# Altium project miniVent_PCB_prj.PrjPcb
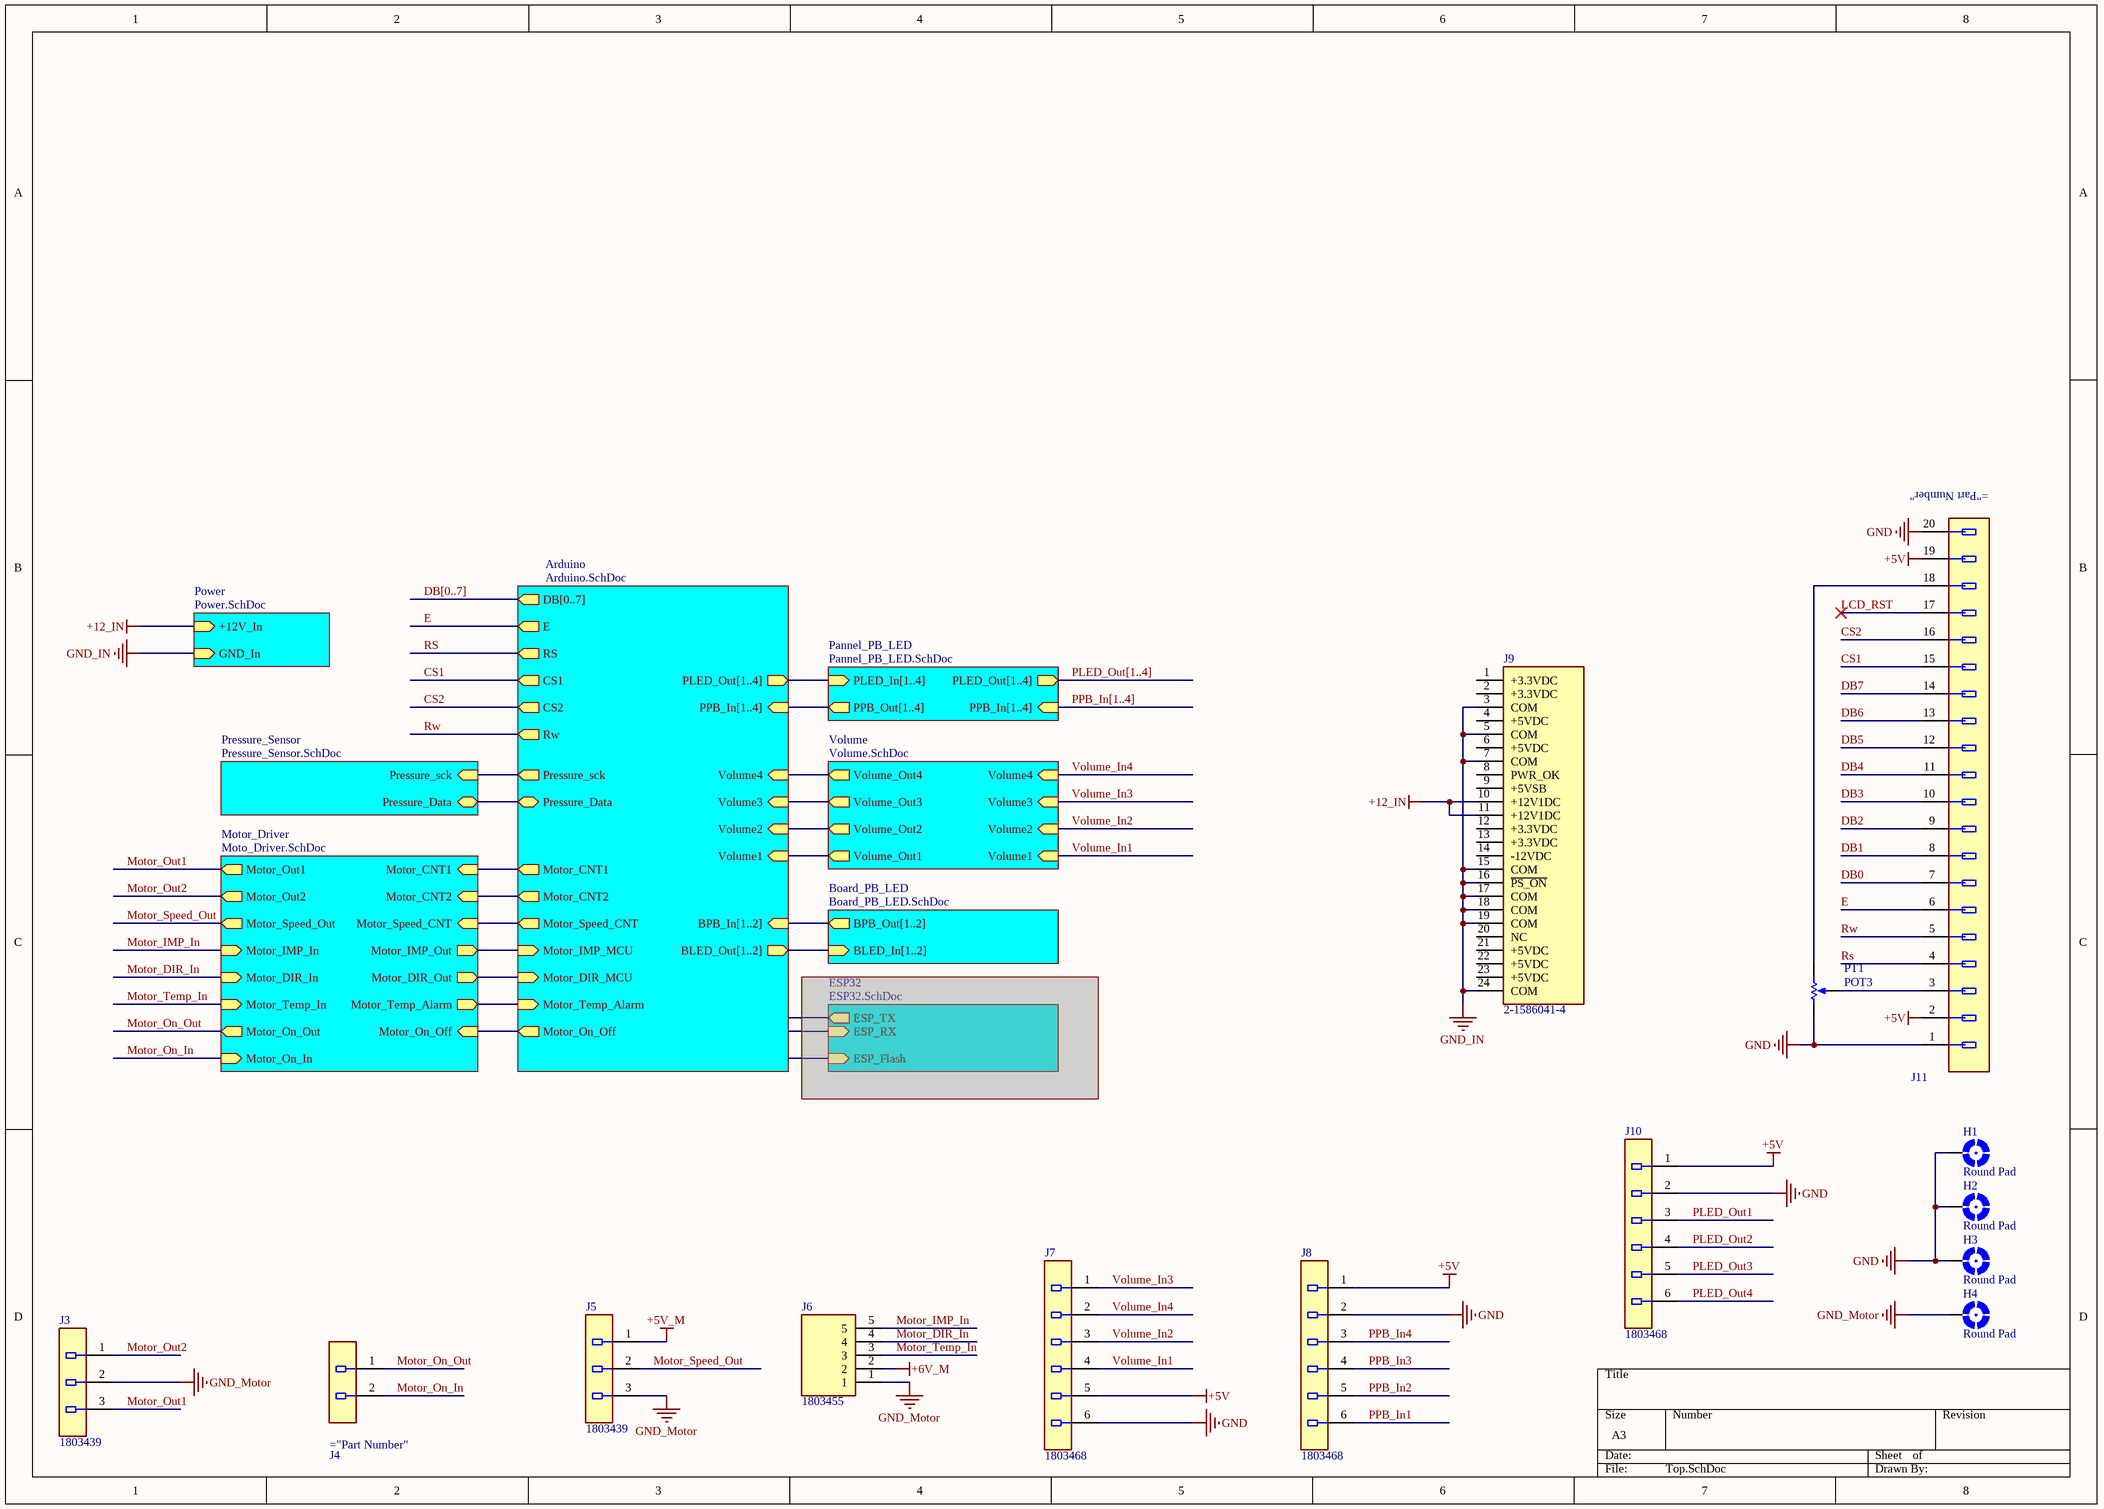
[diagram p0: Top.SchDoc]
8 sheets, 164 parts. Net scope: hierarchical (ports join the sheet entries above them; power ports are global).
Board file: miniVent_PCB_v1_0.PcbDoc
Sheets:
  Top.SchDoc
    Power = Power.SchDoc
    Arduino = Arduino.SchDoc
    Pannel_PB_LED = Pannel_PB_LED.SchDoc
    Volume = Volume.SchDoc
    Board_PB_LED = Board_PB_LED.SchDoc
    Motor_Driver = Moto_Driver.SchDoc
    Pressure_Sensor = Pressure_Sensor.SchDoc

## Sheet Top.SchDoc
size A3

### Parts
H1  Round Pad  [P3.0C]  (no BOM)
H2  Round Pad  [P3.0C]  (no BOM)
H3  Round Pad  [P3.0C]  (no BOM)
H4  Round Pad  [P3.0C]  (no BOM)
J3  Part Number: 1803439  [Phoenix_Contact_1803439_0]  (hidden comment: Conn_Phoenix_Contact_1803439_eec)
J4  1843606  [Phoenix_Contact_1843606_MFG]  (value not drawn)
J5  Part Number: 1803439  [Phoenix_Contact_1803439_0]  (hidden comment: Conn_Phoenix_Contact_1803439_eec)
J6  1803455  [SHDR5W100P0X381_1X5_2044X725X920P]
J7  Part Number: 1803468  [Phoenix_Contact_1803468_0]  (hidden comment: Conn_Phoenix_Contact_1803468_eec)
J8  Part Number: 1803468  [Phoenix_Contact_1803468_0]  (hidden comment: Conn_Phoenix_Contact_1803468_eec)
J9  2-1586041-4  [Molex24Pin - Vertical]
J10  Part Number: 1803468  [Phoenix_Contact_1803468_0]  (hidden comment: Conn_Phoenix_Contact_1803468_eec)
J11  TSS-110-01-G-D  [Samtec_Inc._http--suddendocs.samtec.com-prints-tss-tstd.pdf_0]  (value not drawn)
PT1  POT3  [POT3]

### Sub-sheets
Arduino = Arduino.SchDoc: DB[0..7] (out), PLED_Out[1..4] (out), Motor_Temp_Alarm (in), Motor_Speed_CNT (out), Motor_DIR_MCU (in), Volume1 (in), PPB_In[1..4] (in), BPB_In[1..2] (in), Motor_CNT2 (out), Volume3 (in), Motor_CNT1 (out), Pressure_Data (bidir), Motor_On_Off (out), E (out), Volume2 (in), CS2 (out), Volume4 (in), Rw (out), CS1 (out), RS (out), Pressure_sck (out), BLED_Out[1..2] (out), Motor_IMP_MCU (in)
Board_PB_LED = Board_PB_LED.SchDoc: BPB_Out[1..2] (out), BLED_In[1..2] (in)
ESP32 = ESP32.SchDoc (masked out) (file not in this document): ESP_TX (out), ESP_RX (in), ESP_Flash (in)
Motor_Driver = Moto_Driver.SchDoc: Motor_Out1 (out), Motor_CNT1 (in), Motor_CNT2 (in), Motor_Out2 (out), Motor_Speed_CNT (in), Motor_Speed_Out (out), Motor_IMP_Out (out), Motor_On_Out (out), Motor_On_Off (in), Motor_Temp_Alarm (out), Motor_DIR_In (in), Motor_Temp_In (in), Motor_IMP_In (in), Motor_DIR_Out (out), Motor_On_In (in)
Pannel_PB_LED = Pannel_PB_LED.SchDoc: PLED_In[1..4] (in), PLED_Out[1..4] (out), PPB_Out[1..4] (out), PPB_In[1..4] (in)
Power = Power.SchDoc: +12V_In (in), GND_In (in)
Pressure_Sensor = Pressure_Sensor.SchDoc: Pressure_sck (in), Pressure_Data (bidir)
Volume = Volume.SchDoc: Volume_Out3 (out), Volume3 (in), Volume_Out1 (out), Volume2 (in), Volume1 (in), Volume_Out4 (out), Volume_Out2 (out), Volume4 (in)

### Nets
+5V: J7.5 J8.1 J10.1 J11.2 J11.19
+5V_M: J5.1
+6V_M: J6.2
+12_IN: J9.10(+12V1DC) J9.11(+12V1DC) ; sheet Power/+12V_In
GND: H1.P H2.P H3.P H4.P J3.2 J5.3 J6.1 J7.6 J8.2 J10.2 J11.1 J11.20 PT1.1(TOP)  [also labelled GND_Motor, SHIELD]
GND_IN: J9.3(COM) J9.5(COM) J9.7(COM) J9.15(COM) J9.16(~{PS_ON}) J9.17(COM) J9.18(COM) J9.19(COM) J9.24(COM) ; sheet Power/GND_In
CS1: J11.15 ; sheet Arduino/CS1
CS2: J11.16 ; sheet Arduino/CS2
DB0: J11.7
DB1: J11.8
DB2: J11.9
DB3: J11.10
DB4: J11.11
DB5: J11.12
DB6: J11.13
DB7: J11.14
E: J11.6 ; sheet Arduino/E
LCD_RST: J11.17
Motor_CNT1: sheet Arduino/Motor_CNT1, sheet Motor_Driver/Motor_CNT1
Motor_CNT2: sheet Arduino/Motor_CNT2, sheet Motor_Driver/Motor_CNT2
Motor_DIR_In: J6.4 ; sheet Motor_Driver/Motor_DIR_In
Motor_DIR_MCU: sheet Arduino/Motor_DIR_MCU, sheet Motor_Driver/Motor_DIR_Out
Motor_IMP_In: J6.5 ; sheet Motor_Driver/Motor_IMP_In
Motor_IMP_MCU: sheet Arduino/Motor_IMP_MCU, sheet Motor_Driver/Motor_IMP_Out
Motor_On_In: J4.2 ; sheet Motor_Driver/Motor_On_In
Motor_On_Off: sheet Arduino/Motor_On_Off, sheet Motor_Driver/Motor_On_Off
Motor_On_Out: J4.1 ; sheet Motor_Driver/Motor_On_Out
Motor_Out1: J3.3 ; sheet Motor_Driver/Motor_Out1
Motor_Out2: J3.1 ; sheet Motor_Driver/Motor_Out2
Motor_Speed_CNT: sheet Arduino/Motor_Speed_CNT, sheet Motor_Driver/Motor_Speed_CNT
Motor_Speed_Out: J5.2 ; sheet Motor_Driver/Motor_Speed_Out
Motor_Temp_Alarm: sheet Arduino/Motor_Temp_Alarm, sheet Motor_Driver/Motor_Temp_Alarm
Motor_Temp_In: J6.3 ; sheet Motor_Driver/Motor_Temp_In
PLED_Out1: J10.3
PLED_Out2: J10.4
PLED_Out3: J10.5
PLED_Out4: J10.6
PPB_In1: J8.6
PPB_In2: J8.5
PPB_In3: J8.4
PPB_In4: J8.3
Pressure_Data: sheet Arduino/Pressure_Data, sheet Pressure_Sensor/Pressure_Data
Pressure_sck: sheet Arduino/Pressure_sck, sheet Pressure_Sensor/Pressure_sck
Rs: J11.4 ; sheet Arduino/RS
Rw: J11.5 ; sheet Arduino/Rw
Volume1: sheet Arduino/Volume1, sheet Volume/Volume_Out1
Volume2: sheet Arduino/Volume2, sheet Volume/Volume_Out2
Volume3: sheet Arduino/Volume3, sheet Volume/Volume_Out3
Volume4: sheet Arduino/Volume4, sheet Volume/Volume_Out4
Volume_In1: J7.4 ; sheet Volume/Volume1
Volume_In2: J7.3 ; sheet Volume/Volume2
Volume_In3: J7.1 ; sheet Volume/Volume3
Volume_In4: J7.2 ; sheet Volume/Volume4
NetJ11_3: J11.3 PT1.3(TAP)
NetJ11_18: J11.18 PT1.2(BOT)

Not connected (* = marked no-connect by the designer): J9 1(+3.3VDC) 2(+3.3VDC) 4(+5VDC) 6(+5VDC) 8(PWR_OK) 9(+5VSB) 12(+3.3VDC) 13(+3.3VDC) 14(-12VDC) 20(NC) 21(+5VDC) 22(+5VDC) 23(+5VDC)

### Buses and harness runs
bus DB[0..7] = sheet Arduino/DB[0..7]
bus PLED_Out[1..4] = sheet Pannel_PB_LED/PLED_Out[1..4]
bus PPB_In[1..4] = sheet Pannel_PB_LED/PPB_In[1..4]
bus sheet Arduino/BLED_Out[1..2] = sheet Board_PB_LED/BLED_In[1..2]
bus sheet Arduino/BPB_In[1..2] = sheet Board_PB_LED/BPB_Out[1..2]
bus sheet Arduino/PLED_Out[1..4] = sheet Pannel_PB_LED/PLED_In[1..4]
bus sheet Arduino/PPB_In[1..4] = sheet Pannel_PB_LED/PPB_Out[1..4]

### Library data of the parts
H1-H4 = MOUNT-PAD-ROUND: MOUNTING PAD, round
J3 J5 = Conn_Phoenix_Contact_1803439_eec: CONN 3 Position Terminal Block Header, Male Pins, Shrouded (4 Side) 0.150" (3.81mm) Vertical Through Hole; Manufacturer: Phoenix Contact; Current: 8A; Number of Positions: 3; Voltage - UL: 300V; Voltage - IEC: 250V; helpURL: https://upverter.com/upn/revision/15cf6a4194e13e43/; ComponentLink2Description: Datasheet; Temperature: to; Package: HDR03; Supplier 2: Mouser; Price: 1.01681353673; Supplier 1: Digi-Key; ComponentLink1URL: https://upverter.com/upn/revision/15cf6a4194e13e43/; Supplier Part Number 2: 651-1803439; Supplier Part Number 1: 277-1222-ND; ComponentLink1Description: Upverter; ComponentLink2URL: https://www.phoenixcontact.com/online/portal/ca/pxc/product_detail_page/!ut/p/b1/3ZfJjqNIEIafpR6AdrKbI_tmMDuGCwKM2YzBYNanH1epNYcZVdel5YPJEyjEry8y4s-MXbgLYHi_J3CCQPDdaRfe4qnM40fZ3uLr53tIRJSoEwDBCBgIJg5oBjEVUnUIEkF3_u4EsMiu1k492It-sDHlbi8yHOwHVesM1QUjMDMVR8xGsF3fyzpJKbMGb3m-ldRMvdytogjEpUzEa8lZ9WDWMrMfblh9r_G9jx23obf2YSs-2rv4yBnWYYhKP6Qt7R-f_-vW1r0u1lUoq1adcqJY64DoyrtY5gFB9r04PgKRloXATq5-UXB1rJW0WkCjM3884YLv4SwL_MQePAPIbwNofOfsTp4LH7hWnnkOOTArw_XmlI6IdJtrNOQymFamkLNrkZpsxL5rt4NN4RNT9W1XVFr7OAp8r54RYI96zPDufnQMXusajRdMglVtvbrxB4zkJlzcIkvpNmZLT-GVaR_QSeLSBU_I0uAFuzTwPpZg6WzD_F29V3iNVlF0sagDr-69_VydVgaLOBF44TK1Hz-BkW8KZmLvCka8K9i79pj5rj1GvGuPEe_aY8S79pj2tqX4ruahwZ9gJzfSP8E4iSg7m86AZnOldR6lvtQQKldj0xZDx5ipFru0uAyccwdFJyLPVeUWkwuio7balMKGiIEYKou4Ojw-m_Ps-YOed7PU7bu5OO4viE1KIEZPaI6BhEwUT0bv8T26k0lT1IVnyIcTm9RCG5kMLqD80NZGu2IkhFs1DPIH3vnMPiuW1Jh8JiWNGUPCG-poAqyWAhworNYfeYPOlHW-eN3QQH1DreMULztlF5ZJ82tOm1_gV7ekv7q-PY_pIzpnj7i8Rl2cZztPSYeFHbSZ45NiQBxTbG5HO5QHKxGEuGeuICKFNYN7ZEQX7Hj0HuvFFArVRqcxrSpV8utyrCdYB1cMrmtbwBpc5O89Jx22CMvVCSNuOJBiU-BRyMIheo51xkUxYATodnThS4xTbmt-fDxHgPBPN-Wvi_RXAPjmocHOzm4RS0fGiWXpH4pART6L4PfQIW_1ZlVgBro7ILpbb2DzdK06-brDz7rO6A-OXgAPVsd57jPnPvcaA87jZJw9y2VoVqX1c_6TIPxqQfTFguyrBe1XpxQBrxb8-4Tf2sK1HB5fpjB8usL2ZY487eQhJJkBdFs9iq2mnJEoXkVCz7WhQg9okqAqD2tq0EBucCSmsKr8gKUv52hDkiplykueytOF0UzYoeUmPFqGQvNIxiYGMWE9QwxF4uZQ7MispJFQRRE-D0dNlWayA-7UBJNixy0hNw4I1cutopgdIKnHWISwCmAnJ1YYLpTDnfUsz-qpWJ7usHq7Nr53SY6H2_rpLLrUNtkPiZbx_yV6M2edpGen0mYYgE0jJVN_JlbXbdjmwQJ6T7MrddN5WHW45-mnS78TTYdLfpN_EiRfLMiDVwsiLxZ0X03own9d0N8Ff54O_D4b2rFPs511zi7xeH3szDROi-yQTdnV-DzTm7BfofiblYAK-8-XGd7_u6CA_vgHnVCNeg!!/dl4/d5/L2dBISEvZ0FBIS9nQSEh/pw/Z7_9GN6024610FQ50AB2QJ7KT6766/act/id=0/p=downloadId=2845392/p=action=downloadFile/349172715691/-/; RoHS: TRUE; Mouser Part Number: 651-1803439; Digikey Description: CONN 3 Position Terminal Block Header, Male Pins, Shrouded (4 Side) 0.150" (3.81mm) Vertical Through Hole; Digikey Part Number: 277-1222-ND; Lead Free: yes; Pitch: 3.81mm
J6 = 1803455: Connector; Manufacturer_Name: Phoenix Contact; Allied_Number: 70054558; Datasheet Link: http://uk.rs-online.com/web/p/products/2204866; Height: 9.2mm; Manufacturer_Part_Number: 1803455; Mouser Part Number: 651-1803455; Mouser Price/Stock: https://www.mouser.co.uk/ProductDetail/Phoenix-Contact/1803455?qs=ChwaSN6Xm4%252Bowd0eKzWfkQ%3D%3D; RS Part Number: 2204866; RS Price/Stock: http://uk.rs-online.com/web/p/products/2204866; Allied Price/Stock: http://www.alliedelec.com/phoenix-contact-1803455/70054558/
J7 J8 J10 = Conn_Phoenix_Contact_1803468_eec: CONN TERM BLOCK HDR 6POS VERT 3.81MM; Manufacturer: Phoenix Contact; helpURL: https://upverter.com/upn/revision/3db961df2b2b7a0d/; ComponentLink2Description: Datasheet; Temperature: to; Package: HDR6; Supplier 2: Mouser; Price: 1.88397784029; Supplier 1: Digi-Key; ComponentLink1URL: https://upverter.com/upn/revision/3db961df2b2b7a0d/; Supplier Part Number 2: 651-1803468; Supplier Part Number 1: 277-1225-ND; ComponentLink1Description: Upverter; ComponentLink2URL: http://media.digikey.com/pdf/Data%20Sheets/Phoenix%20Contact%20PDFs/1803468.pdf; RoHS: TRUE; Mouser Part Number: 651-1803468; Digikey Description: CONN TERM BLOCK HDR 6POS VERT 3.81MM; Digikey Part Number: 277-1225-ND; Lead Free: yes; Mounting Type: Through Hole
J9 = ATX Power Receptor: ATX main 24 PIN; MF: TE Connectivity; Value: *; TE_purchase_URL: https://www.te.com/usa-en/product-2-1586041-4.html?te_bu=Cor&te_type=disp&te_campaign=seda_glo_cor-seda-global-disp-prtnr-fy19-seda-model-bom-cta_sma-317_1&elqCampaignId=32493; Price: None; Package: None; SnapEDA_Link: https://www.snapeda.com/parts/2-1586041-4/TE%20Connectivity%20AMP%20Connectors/view-part/2469079/?ref=snap; Availability: Unavailable; MP: 2-1586041-4
PT1 = POT3: Variable Potentiometer top adjust; Designer: Seyed Mohsen Ghasemian; WEB: www.picpars.com

## Sheet Power.SchDoc
size A4
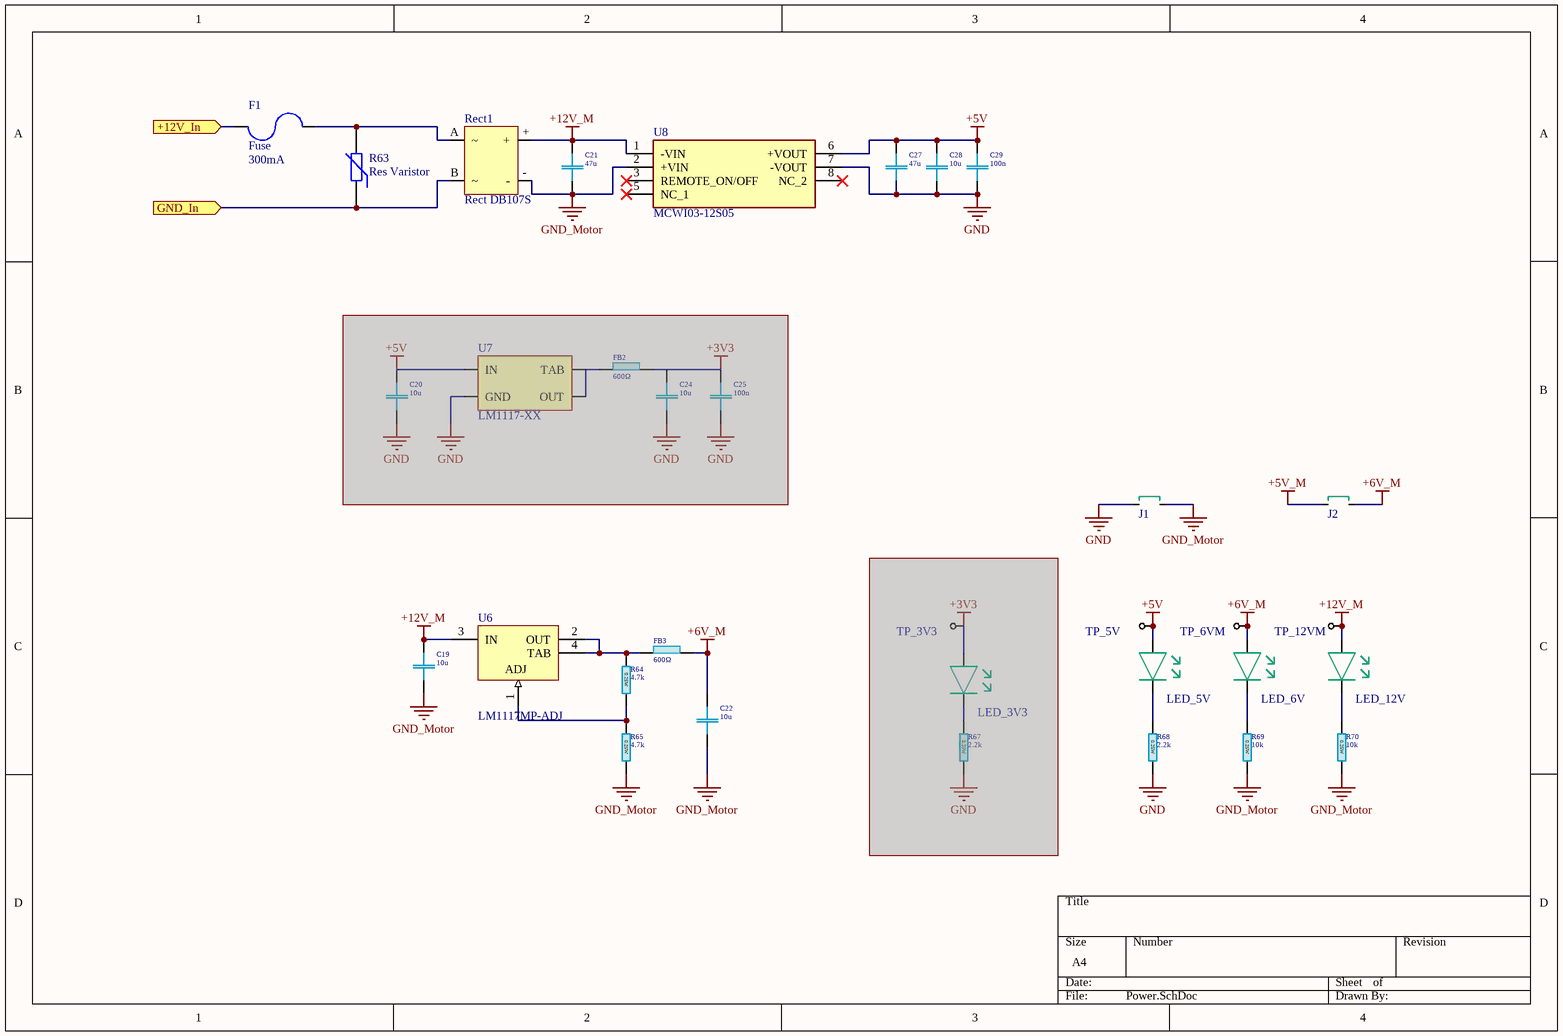
[diagram p1: Power.SchDoc]

### Parts
C19  10u  [C1206]
C20  10u  [C1206]  (masked out: inside a compile mask, not in the netlist)
C21  47u  [C1206]
C22  10u  [C1206]
C24  10u  [C1206]  (masked out: inside a compile mask, not in the netlist)
C25  100n  [C1206]  (masked out: inside a compile mask, not in the netlist)
C27  47u  [C1206]
C28  10u  [C1206]
C29  100n  [C1206]
F1  Fuse  value 300mA  [R1206]
FB2  ZTyp@100MHz: 600Ω  [L1206]  (hidden comment: 0.955u)  (masked out: inside a compile mask, not in the netlist)
FB3  ZTyp@100MHz: 600Ω  [L1206]  (hidden comment: 0.955u)
J1  Jumper  [JUMPER2]  (value not drawn)
J2  Jumper  [JUMPER2]  (value not drawn)
LED_3V3  LED  [LED 1206]  (value not drawn)  (masked out: inside a compile mask, not in the netlist)
LED_5V  LED  [LED 1206]  (value not drawn)
LED_6V  LED  [LED 1206]  (value not drawn)
LED_12V  LED  [LED 1206]  (value not drawn)
R63  Res Varistor  [BOURNS_MOV-07D431K_0]
R64  4.7k  [R1206]
R65  4.7k  [R1206]
R67  2.2k  [R1206]  (masked out: inside a compile mask, not in the netlist)
R68  2.2k  [R1206]
R69  10k  [R1206]
R70  10k  [R1206]
Rect1  Rect DB107S  [DB107S]
TP_3V3  Test Point  [Test Point Small]  (value not drawn)  (masked out: inside a compile mask, not in the netlist)
TP_5V  Test Point  [Test Point Small]  (value not drawn)
TP_6VM  Test Point  [Test Point Small]  (value not drawn)
TP_12VM  Test Point  [Test Point Small]  (value not drawn)
U6  LM1117MP-ADJ  [MP04A_N]
U7  LM1117-XX  [SOT230-LM1117-xx]  (masked out: inside a compile mask, not in the netlist)
U8  MCWI03-12S05  [MCWI0312S05]

### Ports
+12V_In (in), GND_In (in)

### Nets
+5V: C27.1 C28.1 C29.1 LED_5V.A TP_5V.1(T) U8.6(+VOUT)
+5V_M: J2.1
+6V_M: C22.1 FB3.2 J2.2 LED_6V.A TP_6VM.1(T)
+12_IN: F1.1 ; port +12V_In
+12V_M: C19.1 C21.1 LED_12V.A Rect1.+ TP_12VM.1(T) U6.3(IN) U8.1(-VIN)
GND: C19.2 C21.2 C22.2 C27.2 C28.2 C29.2 J1.1 J1.2 R65.2 R68.2 R69.2 R70.2 Rect1.- U8.2(+VIN) U8.7(-VOUT)  [also labelled GND_Motor]
GND_IN: R63.1 Rect1.B ; port GND_In
NetF1_2: F1.2 R63.2 Rect1.A
NetFB3_1: FB3.1 R64.1 U6.2(OUT) U6.4(TAB)
NetLED_5V_K: LED_5V.K R68.1
NetLED_6V_K: LED_6V.K R69.1
NetLED_12V_K: LED_12V.K R70.1
NetR64_2: R64.2 R65.1 U6.1(ADJ)

Not connected (* = marked no-connect by the designer): U8 3(REMOTE_ON/OFF)* 5(NC_1)* 8(NC_2)*

### Library data of the parts
C19-C22 C24 C25 C27-C29 = C 1206  100V X7R - 100n: SMD 1206   100V X7R 10%; Part Number: CL31B104KCFNNNE; Manufacturer: Samsung; TYPE: Capacitors; Package-mm: 3216; Mount Type: SMT; Publisher: Hefest; Manufacturer Alternate: *; Part Number Alternate: *; Published: 07.04.2019; Supplier 1: Comet; Supplier Part Number 1: C1206 100nF 100V X7R SAMSUNG; RoHS: Y; Technology: Ceramic  MLCC; Package: 1206; VDC: 100V; TempCo: X7R; Tolerance %: ±10%; VAC: *; ESR Ohm: *; ComponentLink1Description: Datasheet Link; ComponentLink1URL: https://store.comet.bg/download-file.php?id=11; Temperature Range: -55°C ~ +125°C; Price: 0.090; ComponentLink2Description: Characteristics data; ComponentLink2URL: https://store.comet.bg/download-file.php?id=3821
  C19 C20 C22 C24 C28: Value: 10u
  C21 C27: Value: 47u
  C25 C29: Value: 100n
FB2 FB3 = FB BLM31P 600: SMD 1206 1.5A 600Ω/80mΩ; Part Number: BLM31PG601SN1L; Manufacturer: Murata; TYPE: Ferrite Bead; Ind: 0.955uH; DC Resistance: 80mΩ; Material: Ferrite; Package-mm: 3216; Tolerance %: ±25%; Temperature Range: -55°C ~ +125°C; Imax: 1.5A; Irms: *; Isat: *; Technology: Chip; Published: 07.04.2019; Publisher: Hefest; Mount Type: SMT; Package: 1206; ComponentLink1Description: Datasheet Link; ComponentLink1URL: https://store.comet.bg/download-file.php?id=5324; RoHS: Y; Ztyp@1GHz: *; Manufacturer Alternate: *; Supplier 1: Comet; Supplier Part Number 1: BLM31PG601SN1L; Part Number Alternate: *; Price: 0.161; Value: 0.955u
J1 J2 = Jumper: Jumper Wire; Manufacturer: Generic Components; Published: 1999
R63 = Res Varistor: Varistor (Voltage-Sensitive Resistor); Published: 24-Mar-1999; LatestRevisionDate: 29-May-2009; LatestRevisionNote: IPC-7351 Footprint Added.; PackageVersion: Mar-2003; PackageReference: 6-0805; Publisher: Altium Limited; PackageDescription: Chip Resistor 0805 Case Size; Code_IPC: RESC2012
R64 R65 R67-R70 = R 1206-5%: SMD 1206 0.25W   5% 200V; Manufacturer: YAGEO; TempCo: ±100ppm/°C; Package-mm: 3216; Value Code: 102; Part Number: *; Mount Type: SMT; Publisher: Hefest; Manufacturer Alternate: *; Published: 07.04.2019; Supplier 1: Comet; Supplier Part Number 1: R1206 1.0K 5% YAG/ASJ; RoHS: Y; Technology: Thick film; Package: 1206; VDC: 200V; Tolerance %: ±5%; ComponentLink1Description: Datasheet Link; ComponentLink1URL: https://store.comet.bg/download-file.php?id=140; Temperature Range: -55°C ~ +155°C; Price: 0.054; Part Number Alternate: *; TYPE: Resistor; Power: 0.25W
  R64 R65: Value: 4.7k
  R67 R68: Value: 2.2k
  R69 R70: Value: 10k
Rect1 = DB107S
U6 = LM1117MP-ADJ: 800mA Low-Dropout Linear Regulator, 4-pin SOT-223; Manufacturer: National Semiconductor; PackageTopMarking: XYTT*N03A; High-Reliability: Y; CompType: LDO IC; PowerWise: N; ComponentLink4Description: MP04A Package Page; Code_IPC: SOT223-4; PartNumber: LM1117MP-ADJ; ComponentLink1Description: Manufacturer URL; ComponentLink2Description: LM1117 Datasheet; DatasheetVersion: Apr-2006; ComponentLink3URL: http://www.national.com/pf/LM/LM1117.html; ComponentLink1URL: http://www.national.com/; Code_JEDEC: TO-261-AA; RevisionNote: SCH symbol layout adjusted; ComponentLink4URL: http://www.national.com/packaging/folders/mp04a.html; PackageReference: MP04A; ComponentLink3Description: LM1117 Web Page; PackageVersion: revB, Apr-2003; RoHS: N; PinCount: 4; ComponentLink2URL: http://www.national.com/ds/LM/LM1117.pdf; PackageDescription: Molded SOT-223, 6.50 x 3.56 x 1.6mm Body, 4 Lead, 2.3mm Pitch
U7 = LM1117-XX: voltage regulator
U8 = MCWI03-12S05: Power Supply; Manufacturer_Name: Minmax; Datasheet Link: https://minmax.cdistore.com/datasheets/minmax/MCWI03-R2-110412.pdf; Manufacturer_Part_Number: MCWI03-12S05

## Sheet Arduino.SchDoc
size A4
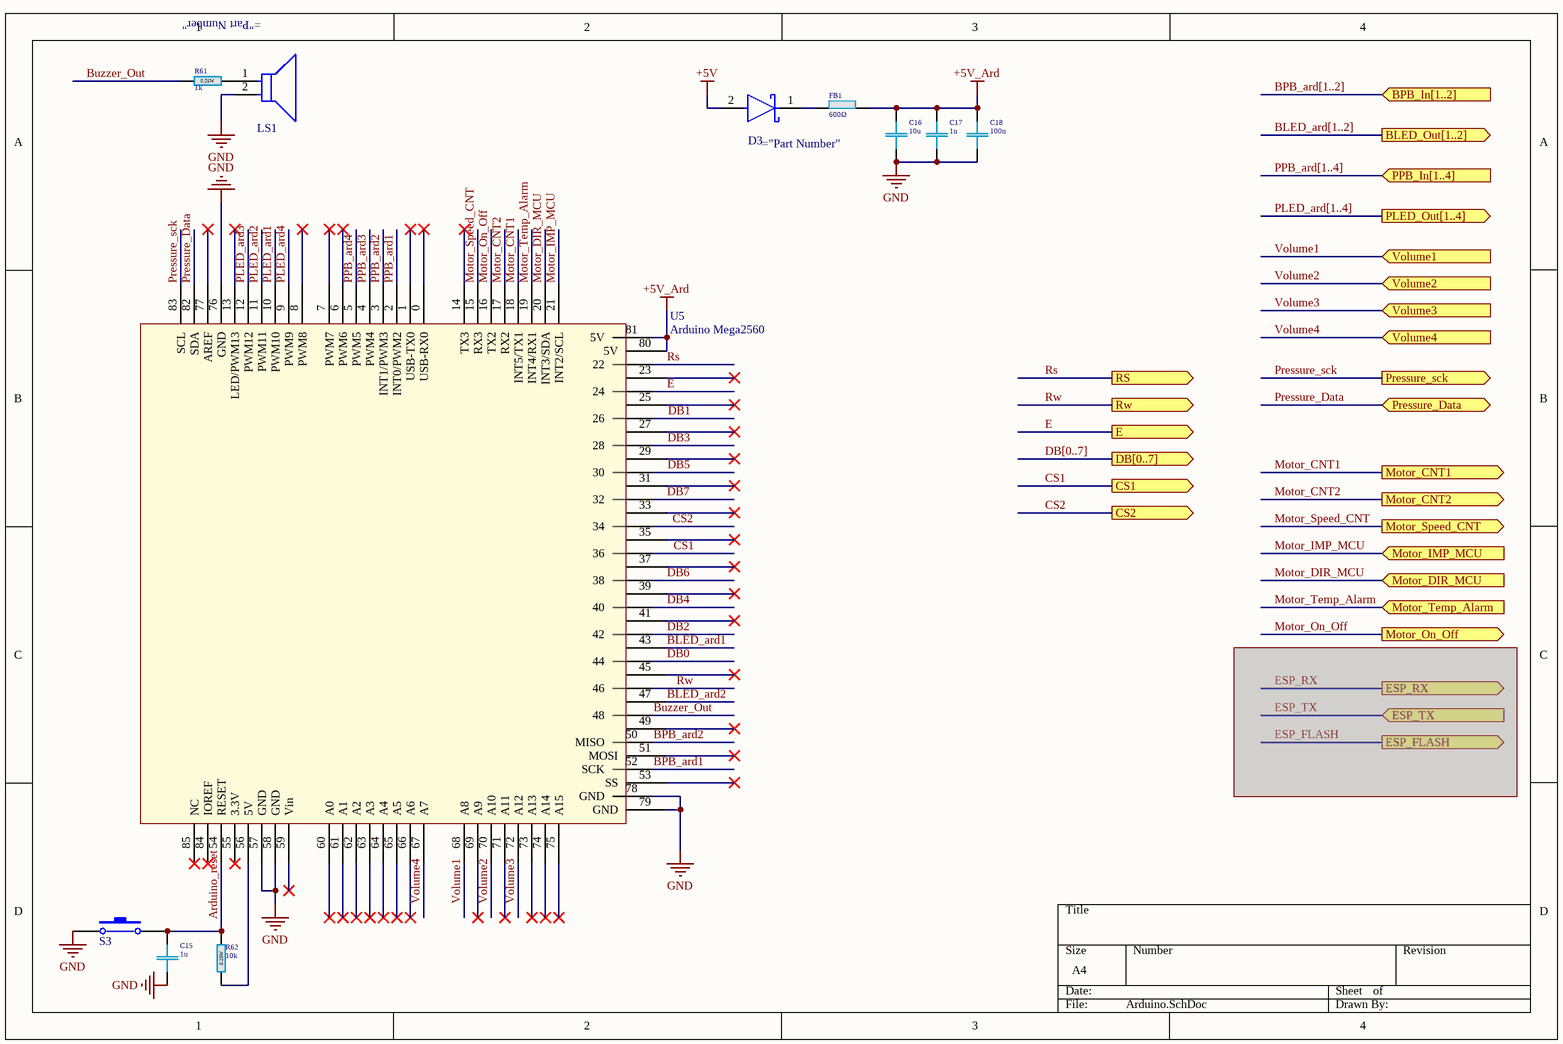
[diagram p2: Arduino.SchDoc]

### Parts
C15  1u  [C1206]
C16  10u  [C1206]
C17  1u  [C1206]
C18  100n  [C1206]
D3  SS34  [DIOM5026X262N]  (value not drawn)
FB1  ZTyp@100MHz: 600Ω  [L1206]  (hidden comment: 0.955u)
LS1  KXG1205C  [BUZZER]  (value not drawn)
R61  1k  [R1206]
R62  10k  [R1206]
S3  PB-2pin  [PB-2pin]  (value not drawn)
U5  Arduino Mega2560  [MEGA2560]

### Ports
BLED_Out[1..2] (out), BPB_In[1..2] (in), CS1 (out), CS2 (out), DB[0..7] (out), E (out), ESP_FLASH (out), ESP_RX (out), ESP_TX (in), Motor_CNT1 (out), Motor_CNT2 (out), Motor_DIR_MCU (in), Motor_IMP_MCU (in), Motor_On_Off (out), Motor_Speed_CNT (out), Motor_Temp_Alarm (in), PLED_Out[1..4] (out), PPB_In[1..4] (in), Pressure_Data (bidir), Pressure_sck (out), RS (out), Rw (out), Volume1 (in), Volume2 (in), Volume3 (in), Volume4 (in)

### Nets
+5V: D3.2(A)
+5V_Ard: C16.1 C17.1 C18.1 FB1.2 U5.80(5V) U5.81(5V)
GND: C15.2 C16.2 C17.2 C18.2 LS1.2(C) S3.1 U5.57(GND) U5.58(GND) U5.76(GND) U5.78(GND) U5.79(GND)
Arduino_reset: C15.1 R62.2 S3.2 U5.54(RESET)
BLED_ard1: U5.43
BLED_ard2: U5.47
BPB_ard1: U5.52(SCK)
BPB_ard2: U5.50(MISO)
Buzzer_Out: R61.1 U5.48
CS1: U5.36 ; port CS1
CS2: U5.34 ; port CS2
DB0: U5.44
DB1: U5.26
DB2: U5.42
DB3: U5.28
DB4: U5.40
DB5: U5.30
DB6: U5.38
DB7: U5.32
E: U5.24 ; port E
Motor_CNT1: U5.18(INT5/TX1) ; port Motor_CNT1
Motor_CNT2: U5.17(RX2) ; port Motor_CNT2
Motor_DIR_MCU: U5.20(INT3/SDA) ; port Motor_DIR_MCU
Motor_IMP_MCU: U5.21(INT2/SCL) ; port Motor_IMP_MCU
Motor_On_Off: U5.16(TX2) ; port Motor_On_Off
Motor_Speed_CNT: U5.15(RX3) ; port Motor_Speed_CNT
Motor_Temp_Alarm: U5.19(INT4/RX1) ; port Motor_Temp_Alarm
PLED_ard1: U5.10(PWM10)
PLED_ard2: U5.11(PWM11)
PLED_ard3: U5.12(PWM12)
PLED_ard4: U5.9(PWM9)
PPB_ard1: U5.2(INT0/PWM2)
PPB_ard2: U5.3(INT1/PWM3)
PPB_ard3: U5.4(PWM4)
PPB_ard4: U5.5(PWM5)
Pressure_Data: U5.82(SDA) ; port Pressure_Data
Pressure_sck: U5.83(SCL) ; port Pressure_sck
Rs: U5.22 ; port RS
Rw: U5.46 ; port Rw
Volume1: U5.68(A8) ; port Volume1
Volume2: U5.70(A10) ; port Volume2
Volume3: U5.72(A12) ; port Volume3
Volume4: U5.67(A7) ; port Volume4
NetD3_1: D3.1(C) FB1.1
NetLS1_1: LS1.1(A) R61.2
NetR62_1: R62.1 U5.56(5V)

Not connected (* = marked no-connect by the designer): U5 0(USB-RX0)* 1(USB-TX0)* 6(PWM6)* 7(PWM7)* 8(PWM8)* 13(LED/PWM13)* 14(TX3)* 23* 25* 27* 29* 31* 33* 35* 37* 39* 41* 45* 49* 51(MOSI)* 53(SS)* 55(3.3V)* 59(Vin)* 60(A0)* 61(A1)* 62(A2)* 63(A3)* 64(A4)* 65(A5)* 66(A6)* 69(A9)* 71(A11)* 73(A13)* 74(A14)* 75(A15)* 77(AREF)* 84(IOREF)* 85(NC)*

### Buses and harness runs
bus BLED_ard[1..2] = port BLED_Out[1..2]
bus BPB_ard[1..2] = port BPB_In[1..2]
bus DB[0..7] = port DB[0..7]
bus PLED_ard[1..4] = port PLED_Out[1..4]
bus PPB_ard[1..4] = port PPB_In[1..4]

### Library data of the parts
C15-C18 = C 1206  100V X7R - 100n: as C19 on sheet Power; Mount Type: SMT; Publisher: Hefest; Manufacturer Alternate: *; Part Number Alternate: *; Published: 07.04.2019; Supplier 1: Comet; Supplier Part Number 1: C1206 100nF 100V X7R SAMSUNG; RoHS: Y; Technology: Ceramic  MLCC; Package: 1206; VDC: 100V; TempCo: X7R; Tolerance %: ±10%; VAC: *; ESR Ohm: *; ComponentLink1Description: Datasheet Link; ComponentLink1URL: https://store.comet.bg/download-file.php?id=11; Temperature Range: -55°C ~ +125°C; Price: 0.090; ComponentLink2Description: Characteristics data; ComponentLink2URL: https://store.comet.bg/download-file.php?id=3821
  C15 C17: Value: 1u
  C16: Value: 10u
  C18: Value: 100n
FB1 = FB BLM31P 600: as FB2 on sheet Power; Temperature Range: -55°C ~ +125°C; Imax: 1.5A; Irms: *; Isat: *; Technology: Chip; Published: 07.04.2019; Publisher: Hefest; Mount Type: SMT; Package: 1206; ComponentLink1Description: Datasheet Link; ComponentLink1URL: https://store.comet.bg/download-file.php?id=5324; RoHS: Y; Ztyp@1GHz: *; Manufacturer Alternate: *; Supplier 1: Comet; Supplier Part Number 1: BLM31PG601SN1L; Part Number Alternate: *; Price: 0.161; Value: 0.955u
R61 R62 = R 1206-5%: as R64 on sheet Power; Part Number: *; Mount Type: SMT; Publisher: Hefest; Manufacturer Alternate: *; Published: 07.04.2019; Supplier 1: Comet; Supplier Part Number 1: R1206 1.0K 5% YAG/ASJ; RoHS: Y; Technology: Thick film; Package: 1206; VDC: 200V; Tolerance %: ±5%; ComponentLink1Description: Datasheet Link; ComponentLink1URL: https://store.comet.bg/download-file.php?id=140; Temperature Range: -55°C ~ +155°C; Price: 0.054; Part Number Alternate: *; TYPE: Resistor; Power: 0.25W
  R61: Value: 1k
  R62: Value: 10k
S3 = PB-2pin: Switch; E-mail: picpars@gmail.com; Designer: Seyed Mohsen Ghasemian; Publisher: www.picpars.com; WEB: www.picpars.com
U5 = Mega_2560: Arduino Mege 2560 R3

## Sheet Pannel_PB_LED.SchDoc
size A4
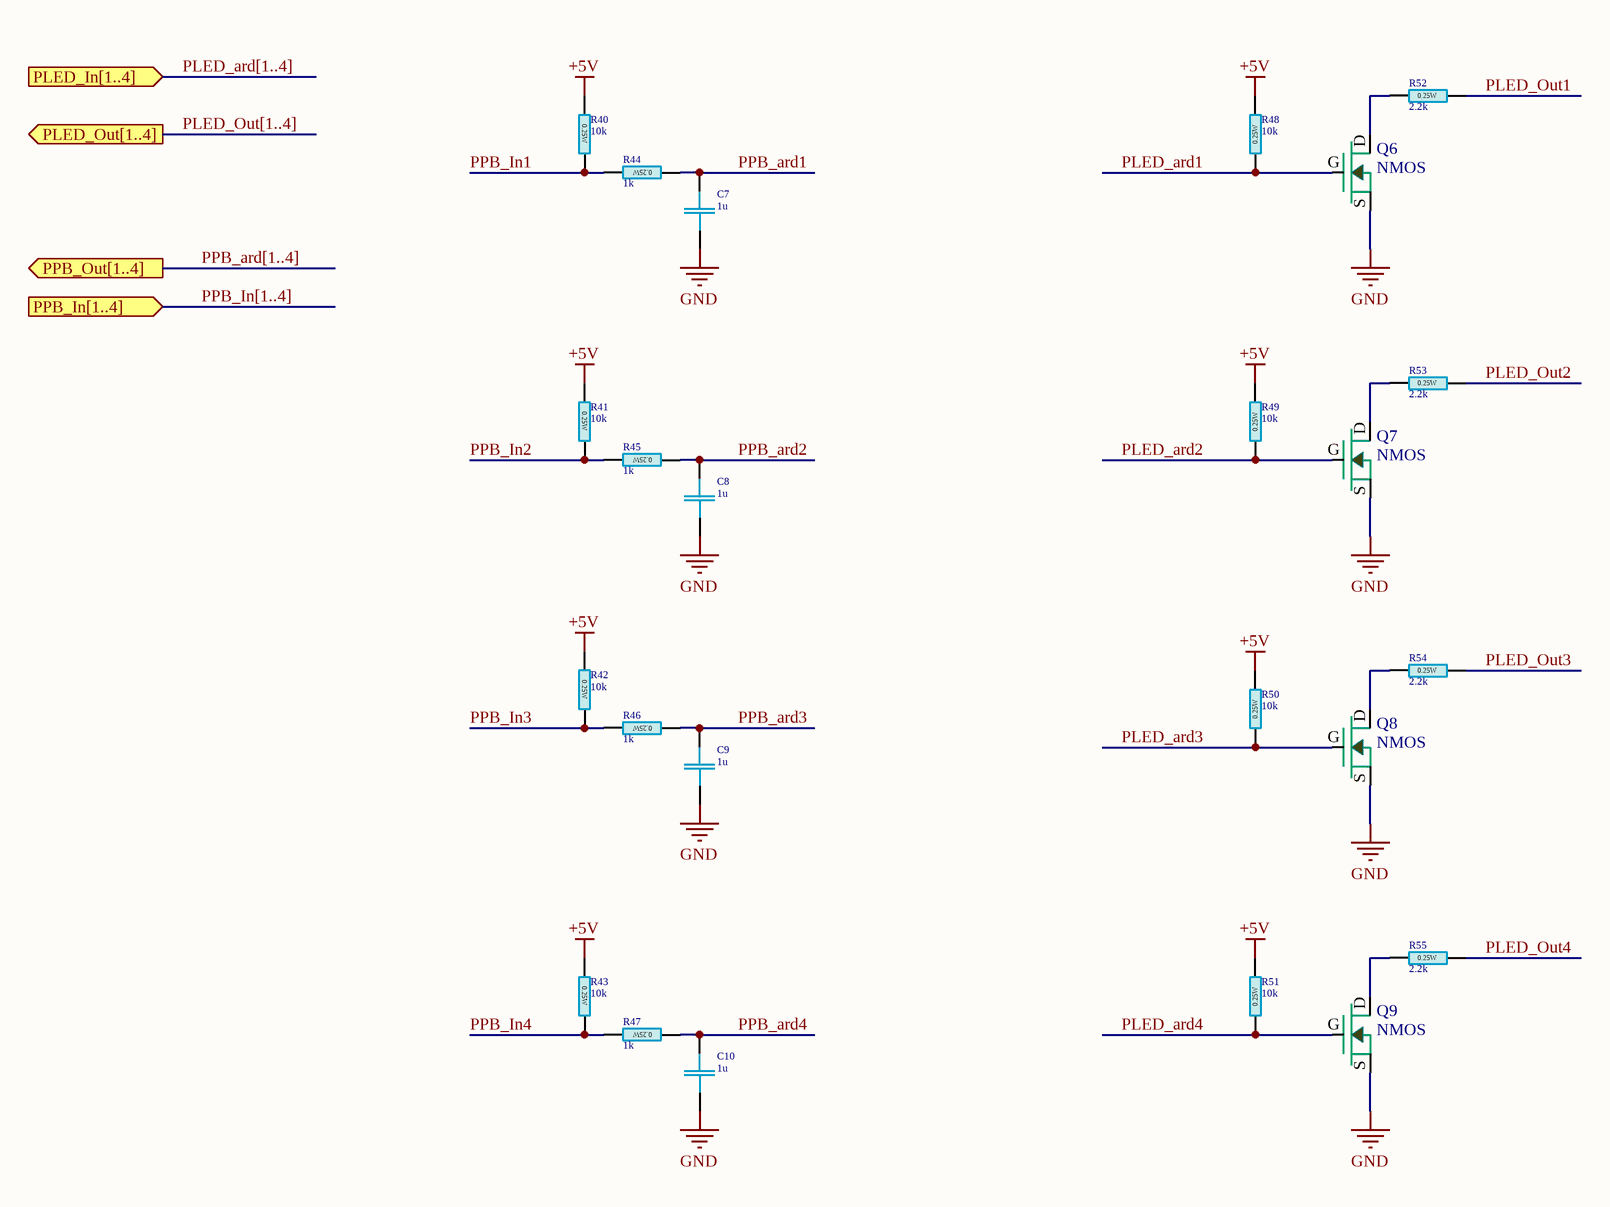
[diagram p3: Pannel_PB_LED.SchDoc]

### Parts
C7  1u  [C1206]
C8  1u  [C1206]
C9  1u  [C1206]
C10  1u  [C1206]
Q6  NMOS  [NMOS SOT-23]
Q7  NMOS  [NMOS SOT-23]
Q8  NMOS  [NMOS SOT-23]
Q9  NMOS  [NMOS SOT-23]
R40  10k  [R1206]
R41  10k  [R1206]
R42  10k  [R1206]
R43  10k  [R1206]
R44  1k  [R1206]
R45  1k  [R1206]
R46  1k  [R1206]
R47  1k  [R1206]
R48  10k  [R1206]
R49  10k  [R1206]
R50  10k  [R1206]
R51  10k  [R1206]
R52  2.2k  [R1206]
R53  2.2k  [R1206]
R54  2.2k  [R1206]
R55  2.2k  [R1206]

### Ports
PLED_In[1..4] (in), PLED_Out[1..4] (out), PPB_In[1..4] (in), PPB_Out[1..4] (out)

### Nets
+5V: R40.1 R41.1 R42.1 R43.1 R48.2 R49.2 R50.2 R51.2
GND: C7.2 C8.2 C9.2 C10.2 Q6.S Q7.S Q8.S Q9.S
PLED_ard1: Q6.G R48.1
PLED_ard2: Q7.G R49.1
PLED_ard3: Q8.G R50.1
PLED_ard4: Q9.G R51.1
PLED_Out1: R52.2
PLED_Out2: R53.2
PLED_Out3: R54.2
PLED_Out4: R55.2
PPB_ard1: C7.1 R44.1
PPB_ard2: C8.1 R45.1
PPB_ard3: C9.1 R46.1
PPB_ard4: C10.1 R47.1
PPB_In1: R40.2 R44.2
PPB_In2: R41.2 R45.2
PPB_In3: R42.2 R46.2
PPB_In4: R43.2 R47.2
NetQ6_D: Q6.D R52.1
NetQ7_D: Q7.D R53.1
NetQ8_D: Q8.D R54.1
NetQ9_D: Q9.D R55.1

### Buses and harness runs
bus PLED_ard[1..4] = port PLED_In[1..4]
bus PLED_Out[1..4] = port PLED_Out[1..4]
bus PPB_ard[1..4] = port PPB_Out[1..4]
bus PPB_In[1..4] = port PPB_In[1..4]

### Library data of the parts
C7-C10 = C 1206  100V X7R - 100n: as C19 on sheet Power; Mount Type: SMT; Publisher: Hefest; Manufacturer Alternate: *; Part Number Alternate: *; Published: 07.04.2019; Supplier 1: Comet; Supplier Part Number 1: C1206 100nF 100V X7R SAMSUNG; RoHS: Y; Technology: Ceramic  MLCC; Package: 1206; VDC: 100V; TempCo: X7R; Tolerance %: ±10%; VAC: *; ESR Ohm: *; ComponentLink1Description: Datasheet Link; ComponentLink1URL: https://store.comet.bg/download-file.php?id=11; Temperature Range: -55°C ~ +125°C; Price: 0.090; ComponentLink2Description: Characteristics data; ComponentLink2URL: https://store.comet.bg/download-file.php?id=3821; Value: 1u
R40-R55 = R 1206-5%: as R64 on sheet Power; Part Number: *; Mount Type: SMT; Publisher: Hefest; Manufacturer Alternate: *; Published: 07.04.2019; Supplier 1: Comet; Supplier Part Number 1: R1206 1.0K 5% YAG/ASJ; RoHS: Y; Technology: Thick film; Package: 1206; VDC: 200V; Tolerance %: ±5%; ComponentLink1Description: Datasheet Link; ComponentLink1URL: https://store.comet.bg/download-file.php?id=140; Temperature Range: -55°C ~ +155°C; Price: 0.054; Part Number Alternate: *; TYPE: Resistor; Power: 0.25W
  R40-R43 R48-R51: Value: 10k
  R44-R47: Value: 1k
  R52-R55: Value: 2.2k

## Sheet Volume.SchDoc
size A4
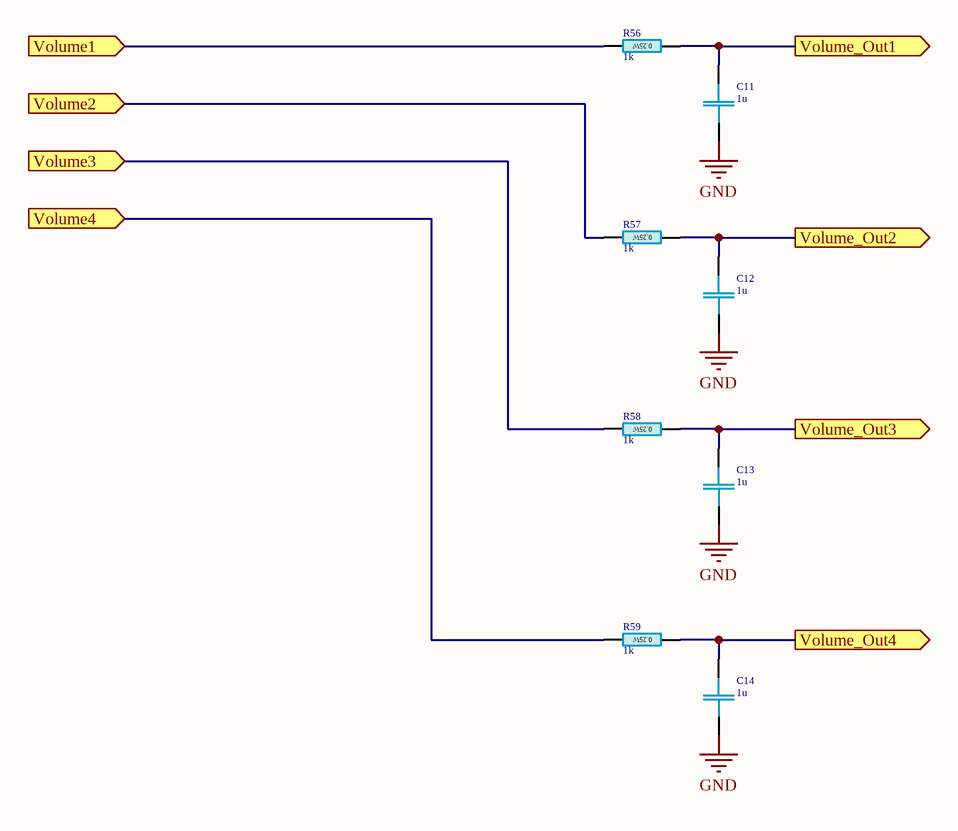
[diagram p4: Volume.SchDoc]

### Parts
C11  1u  [C1206]
C12  1u  [C1206]
C13  1u  [C1206]
C14  1u  [C1206]
R56  1k  [R1206]
R57  1k  [R1206]
R58  1k  [R1206]
R59  1k  [R1206]

### Ports
Volume1 (in), Volume2 (in), Volume3 (in), Volume4 (in), Volume_Out1 (out), Volume_Out2 (out), Volume_Out3 (out), Volume_Out4 (out)

### Nets
GND: C11.2 C12.2 C13.2 C14.2
Volume1: C11.1 R56.1 ; port Volume_Out1
Volume2: C12.1 R57.1 ; port Volume_Out2
Volume3: C13.1 R58.1 ; port Volume_Out3
Volume4: C14.1 R59.1 ; port Volume_Out4
Volume_In1: R56.2 ; port Volume1
Volume_In2: R57.2 ; port Volume2
Volume_In3: R58.2 ; port Volume3
Volume_In4: R59.2 ; port Volume4

### Library data of the parts
C11-C14 = C 1206  100V X7R - 100n: as C19 on sheet Power; Mount Type: SMT; Publisher: Hefest; Manufacturer Alternate: *; Part Number Alternate: *; Published: 07.04.2019; Supplier 1: Comet; Supplier Part Number 1: C1206 100nF 100V X7R SAMSUNG; RoHS: Y; Technology: Ceramic  MLCC; Package: 1206; VDC: 100V; TempCo: X7R; Tolerance %: ±10%; VAC: *; ESR Ohm: *; ComponentLink1Description: Datasheet Link; ComponentLink1URL: https://store.comet.bg/download-file.php?id=11; Temperature Range: -55°C ~ +125°C; Price: 0.090; ComponentLink2Description: Characteristics data; ComponentLink2URL: https://store.comet.bg/download-file.php?id=3821; Value: 1u
R56-R59 = R 1206-5%: as R64 on sheet Power; Part Number: *; Mount Type: SMT; Publisher: Hefest; Manufacturer Alternate: *; Published: 07.04.2019; Supplier 1: Comet; Supplier Part Number 1: R1206 1.0K 5% YAG/ASJ; RoHS: Y; Technology: Thick film; Package: 1206; VDC: 200V; Tolerance %: ±5%; ComponentLink1Description: Datasheet Link; ComponentLink1URL: https://store.comet.bg/download-file.php?id=140; Temperature Range: -55°C ~ +155°C; Price: 0.054; Part Number Alternate: *; TYPE: Resistor; Power: 0.25W; Value: 1k

## Sheet Board_PB_LED.SchDoc
size A4
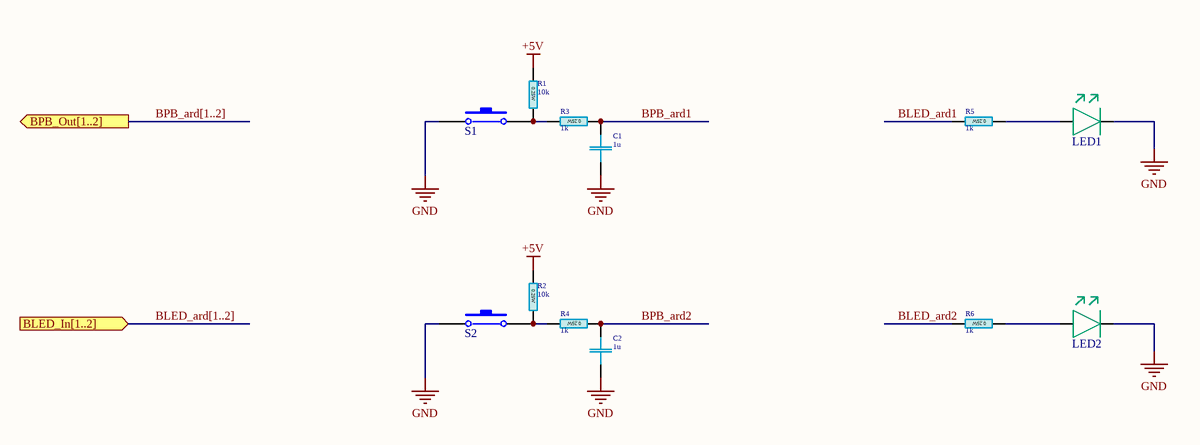
[diagram p5: Board_PB_LED.SchDoc]

### Parts
C1  1u  [C1206]
C2  1u  [C1206]
LED1  LED  [LED 1206]  (value not drawn)
LED2  LED  [LED 1206]  (value not drawn)
R1  10k  [R1206]
R2  10k  [R1206]
R3  1k  [R1206]
R4  1k  [R1206]
R5  1k  [R1206]
R6  1k  [R1206]
S1  PB-2pin  [PB-2pin]  (value not drawn)
S2  PB-2pin  [PB-2pin]  (value not drawn)

### Ports
BLED_In[1..2] (in), BPB_Out[1..2] (out)

### Nets
+5V: R1.1 R2.1
GND: C1.2 C2.2 LED1.K LED2.K S1.1 S2.1
BLED_ard1: R5.2
BLED_ard2: R6.2
BPB_ard1: C1.1 R3.1
BPB_ard2: C2.1 R4.1
NetLED1_A: LED1.A R5.1
NetLED2_A: LED2.A R6.1
NetR1_2: R1.2 R3.2 S1.2
NetR2_2: R2.2 R4.2 S2.2

### Buses and harness runs
bus BLED_ard[1..2] = port BLED_In[1..2]
bus BPB_ard[1..2] = port BPB_Out[1..2]

### Library data of the parts
C1 C2 = C 1206  100V X7R - 100n: as C19 on sheet Power; Mount Type: SMT; Publisher: Hefest; Manufacturer Alternate: *; Part Number Alternate: *; Published: 07.04.2019; Supplier 1: Comet; Supplier Part Number 1: C1206 100nF 100V X7R SAMSUNG; RoHS: Y; Technology: Ceramic  MLCC; Package: 1206; VDC: 100V; TempCo: X7R; Tolerance %: ±10%; VAC: *; ESR Ohm: *; ComponentLink1Description: Datasheet Link; ComponentLink1URL: https://store.comet.bg/download-file.php?id=11; Temperature Range: -55°C ~ +125°C; Price: 0.090; ComponentLink2Description: Characteristics data; ComponentLink2URL: https://store.comet.bg/download-file.php?id=3821; Value: 1u
R1-R6 = R 1206-5%: as R64 on sheet Power; Part Number: *; Mount Type: SMT; Publisher: Hefest; Manufacturer Alternate: *; Published: 07.04.2019; Supplier 1: Comet; Supplier Part Number 1: R1206 1.0K 5% YAG/ASJ; RoHS: Y; Technology: Thick film; Package: 1206; VDC: 200V; Tolerance %: ±5%; ComponentLink1Description: Datasheet Link; ComponentLink1URL: https://store.comet.bg/download-file.php?id=140; Temperature Range: -55°C ~ +155°C; Price: 0.054; Part Number Alternate: *; TYPE: Resistor; Power: 0.25W
  R1 R2: Value: 10k
  R3-R6: Value: 1k
S1 S2 = PB-2pin: as S3 on sheet Arduino; Publisher: www.picpars.com; WEB: www.picpars.com

## Sheet Moto_Driver.SchDoc
size A3
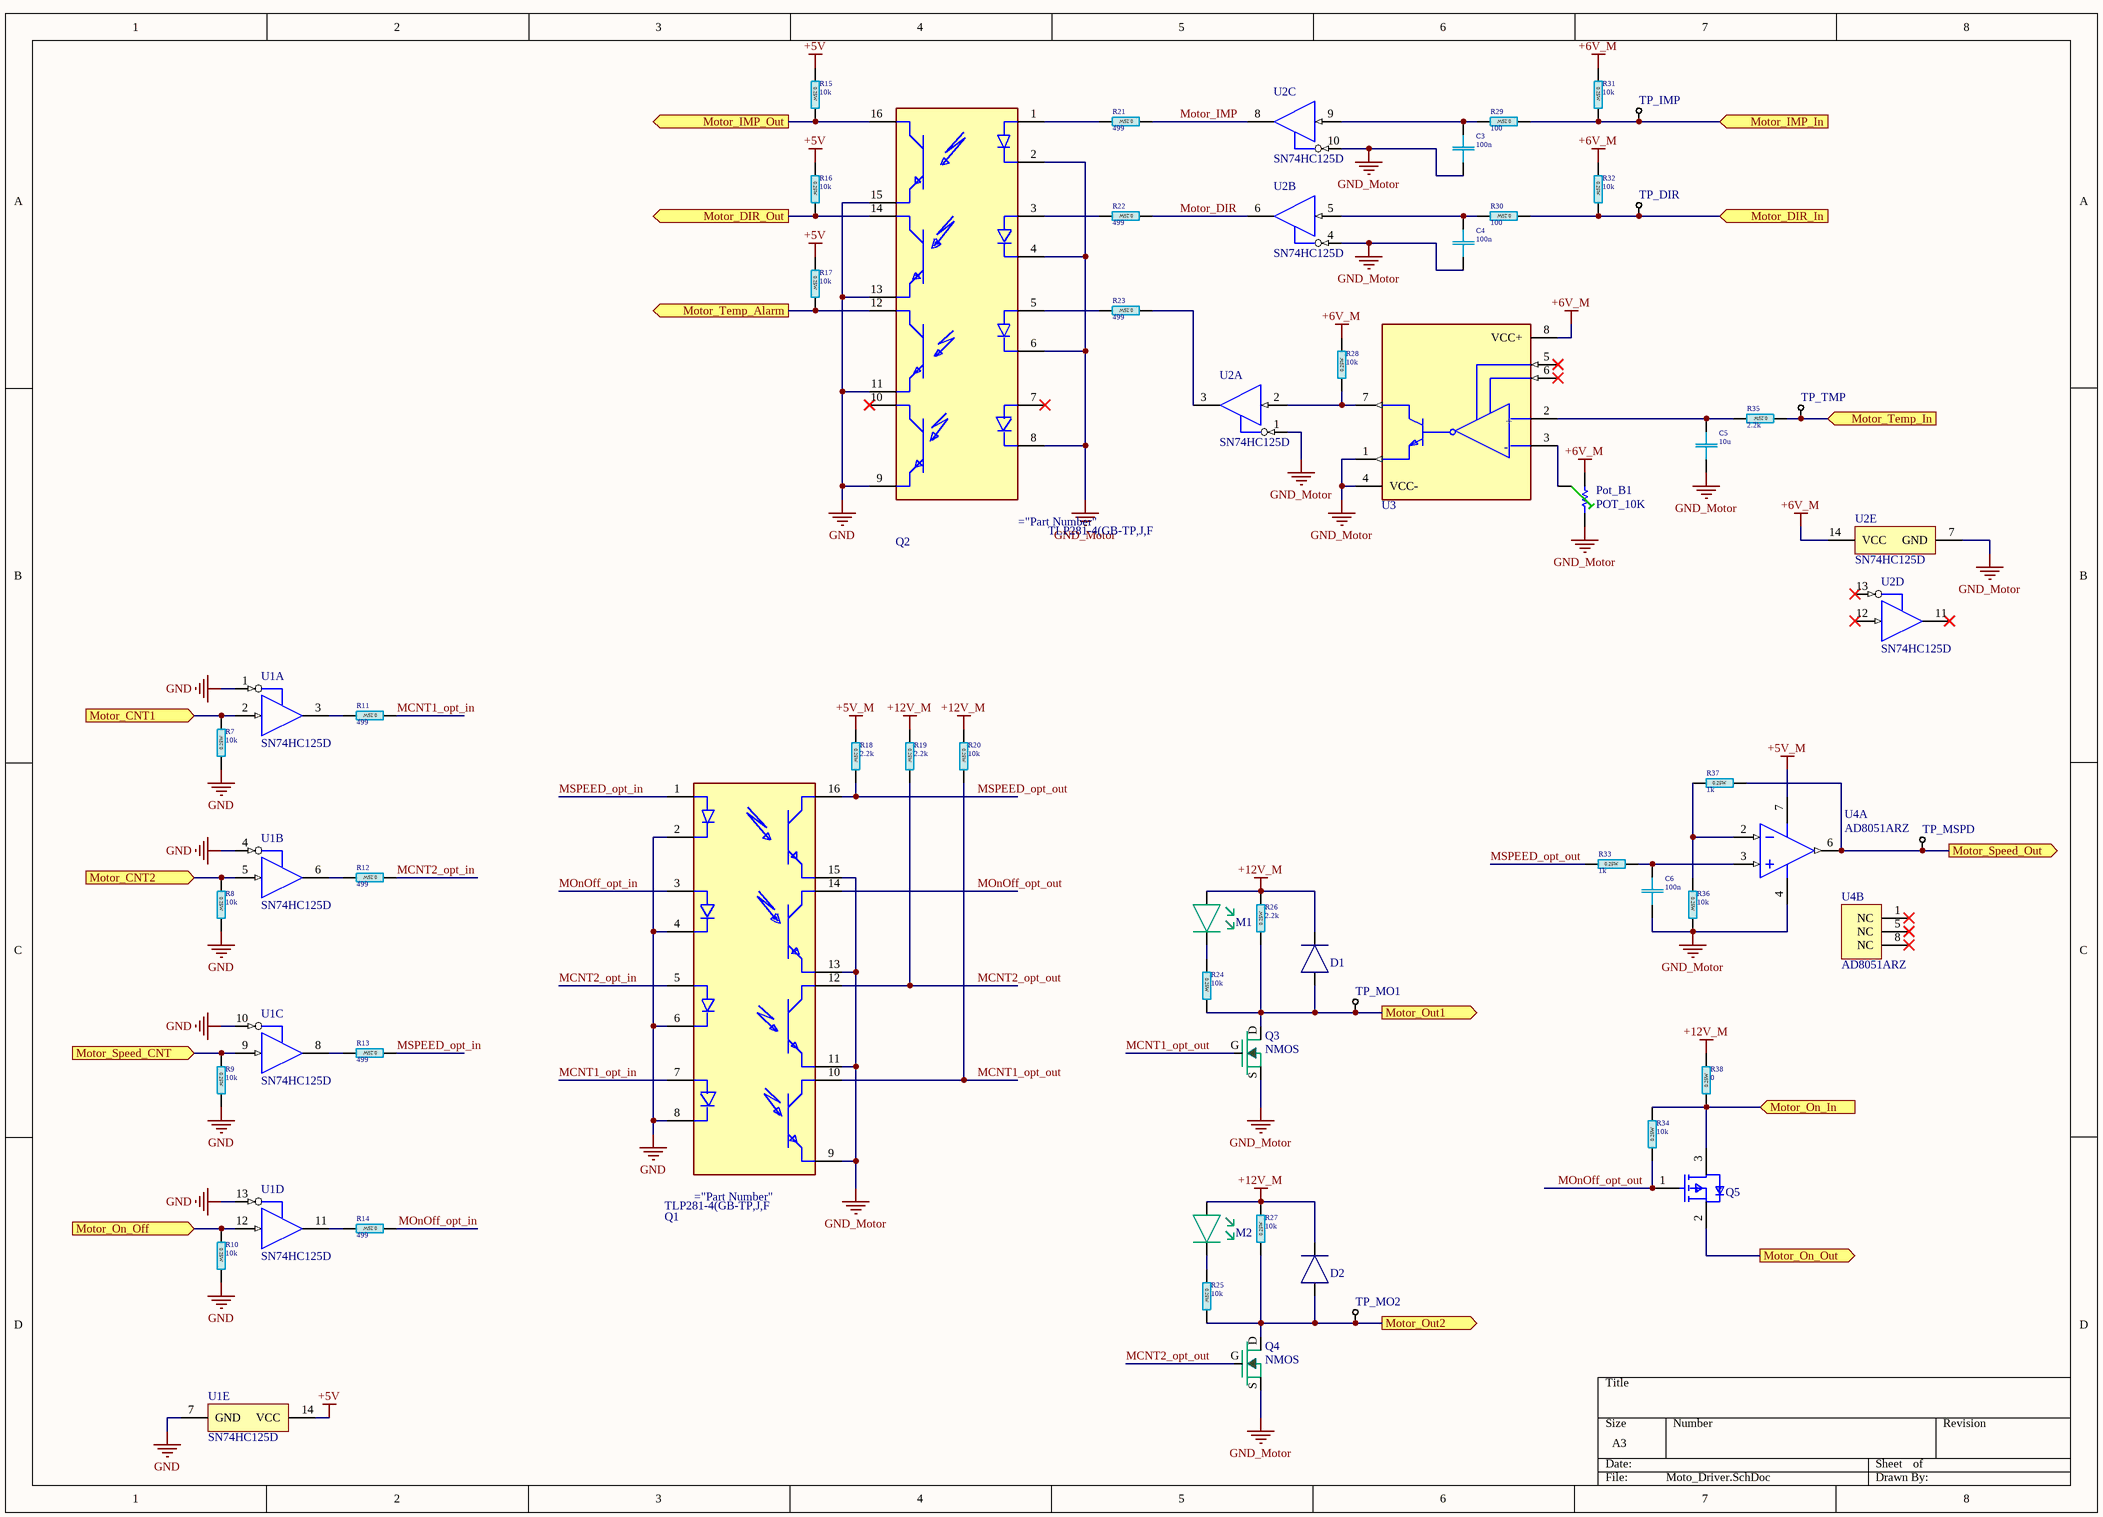
[diagram p6: Moto_Driver.SchDoc]

### Parts
C3  100n  [C1206]
C4  100n  [C1206]
C5  10u  [C1206]
C6  100n  [C1206]
D1  Diode  [Diode-M7]  (value not drawn)
D2  Diode  [Diode-M7]  (value not drawn)
M1  LED  [LED 1206]  (value not drawn)
M2  LED  [LED 1206]  (value not drawn)
Pot_B1  POT_10K  [3296W]
Q1  TLP281-4_GB-TP,J,F  [Toshiba_11-10F1_0]  (value not drawn)
Q2  TLP281-4_GB-TP,J,F  [Toshiba_11-10F1_0]  (value not drawn)
Q3  NMOS  [NMOS SOT-23]
Q4  NMOS  [NMOS SOT-23]
Q5  FDN360P  [ON_Semiconductor_527AG-01_IPC_A]  (value not drawn)
R7  10k  [R1206]
R8  10k  [R1206]
R9  10k  [R1206]
R10  10k  [R1206]
R11  499  [R1206]
R12  499  [R1206]
R13  499  [R1206]
R14  499  [R1206]
R15  10k  [R1206]
R16  10k  [R1206]
R17  10k  [R1206]
R18  2.2k  [R1206]
R19  2.2k  [R1206]
R20  10k  [R1206]
R21  499  [R1206]
R22  499  [R1206]
R23  499  [R1206]
R24  10k  [R1206]
R25  10k  [R1206]
R26  2.2k  [R1206]
R27  10k  [R1206]
R28  10k  [R1206]
R29  100  [R1206]
R30  100  [R1206]
R31  10k  [R1206]
R32  10k  [R1206]
R33  1k  [R1206]
R34  10k  [R1206]
R35  2.2k  [R1206]
R36  10k  [R1206]
R37  1k  [R1206]
R38  0  [R1206]
TP_DIR  Test Point  [Test Point Small]  (value not drawn)
TP_IMP  Test Point  [Test Point Small]  (value not drawn)
TP_MO1  Test Point  [Test Point Small]  (value not drawn)
TP_MO2  Test Point  [Test Point Small]  (value not drawn)
TP_MSPD  Test Point  [Test Point Small]  (value not drawn)
TP_TMP  Test Point  [Test Point Small]  (value not drawn)
U1  SN74HC125D  [D0014A_M]  (parts A,B,C,D,E of 5)
U2  SN74HC125D  [D0014A_M]  (parts A,B,C,D,E of 5)
U3  LM311D  [Texas_Instruments_D_R-PDSO-G8_0]  (value not drawn)
U4  AD8051ARZ  [ADI-R-8_M]  (parts A,B of 2)

### Ports
Motor_CNT1 (in), Motor_CNT2 (in), Motor_DIR_In (in), Motor_DIR_Out (out), Motor_IMP_In (in), Motor_IMP_Out (out), Motor_On_In (in), Motor_On_Off (in), Motor_On_Out (out), Motor_Out1 (out), Motor_Out2 (out), Motor_Speed_CNT (in), Motor_Speed_Out (out), Motor_Temp_Alarm (out), Motor_Temp_In (in)

### Nets
+5V: R15.1 R16.1 R17.1 U1.14(VCC)
+5V_M: R18.1 U4.7(+VS)
+6V_M: Pot_B1.3(CW) R28.2 R31.1 R32.1 U2.14(VCC) U3.8(VCC+)
+12V_M: D1.K D2.K M1.A M2.A R19.1 R20.1 R26.2 R27.2 R38.2
GND: C3.2 C4.2 C5.2 C6.2 Pot_B1.1(CCW) Q1.2(1_CATHODE) Q1.4(2_CATHODE) Q1.6(3_CATHODE) Q1.8(4_CATHODE) Q1.9(E) Q1.11(E) Q1.13(E) Q1.15(E) Q2.2(1_CATHODE) Q2.4(2_CATHODE) Q2.6(3_CATHODE) Q2.8(4_CATHODE) Q2.9(E) Q2.11(E) Q2.13(E) Q2.15(E) Q3.S Q4.S R7.1 R8.2 R9.2 R10.2 R36.2 U1.1(1~{OE}) U1.4(2~{OE}) U1.7(GND) U1.10(3~{OE}) U1.13(4~{OE}) U2.1(1~{OE}) U2.4(2~{OE}) U2.7(GND) U2.10(3~{OE}) U3.1(EMIT_OUT) U3.4(VCC-) U4.4(-VS)  [also labelled GND_Motor]
MCNT1_opt_in: Q1.7(4_ANODE) R11.1
MCNT1_opt_out: Q1.10(C) Q3.G R20.2
MCNT2_opt_in: Q1.5(3_ANODE) R12.1
MCNT2_opt_out: Q1.12(C) Q4.G R19.2
MOnOff_opt_in: Q1.3(2_ANODE) R14.1
MOnOff_opt_out: Q1.14(C) Q5.1(G) R34.1
Motor_CNT1: R7.2 U1.2(1A) ; port Motor_CNT1
Motor_CNT2: R8.1 U1.5(2A) ; port Motor_CNT2
Motor_DIR: R22.1 U2.6(2Y)
Motor_DIR_In: R30.1 R32.2 TP_DIR.1(T) ; port Motor_DIR_In
Motor_DIR_MCU: Q2.14(C) R16.2 ; port Motor_DIR_Out
Motor_IMP: R21.1 U2.8(3Y)
Motor_IMP_In: R29.1 R31.2 TP_IMP.1(T) ; port Motor_IMP_In
Motor_IMP_MCU: Q2.16(C) R15.2 ; port Motor_IMP_Out
Motor_On_In: Q5.3(D) R34.2 R38.1 ; port Motor_On_In
Motor_On_Off: R10.1 U1.12(4A) ; port Motor_On_Off
Motor_On_Out: Q5.2(S) ; port Motor_On_Out
Motor_Out1: D1.A Q3.D R24.2 R26.1 TP_MO1.1(T) ; port Motor_Out1
Motor_Out2: D2.A Q4.D R25.2 R27.1 TP_MO2.1(T) ; port Motor_Out2
Motor_Speed_CNT: R9.1 U1.9(3A) ; port Motor_Speed_CNT
Motor_Speed_Out: R37.2 TP_MSPD.1(T) U4.6(VOUT) ; port Motor_Speed_Out
Motor_Temp_Alarm: Q2.12(C) R17.2 ; port Motor_Temp_Alarm
Motor_Temp_In: R35.1 TP_TMP.1(T) ; port Motor_Temp_In
MSPEED_opt_in: Q1.1(1_ANODE) R13.1
MSPEED_opt_out: Q1.16(C) R18.2 R33.1
NetC3_1: C3.1 R29.2 U2.9(3A)
NetC4_1: C4.1 R30.2 U2.5(2A)
NetC5_1: C5.1 R35.2 U3.2(IN+)
NetC6_1: C6.1 R33.2 U4.3(+IN)
NetM1_K: M1.K R24.1
NetM2_K: M2.K R25.1
NetPot_B1_2: Pot_B1.2(WIPER) U3.3(IN-)
NetQ2_1: Q2.1(1_ANODE) R21.2
NetQ2_3: Q2.3(2_ANODE) R22.2
NetQ2_5: Q2.5(3_ANODE) R23.2
NetR11_2: R11.2 U1.3(1Y)
NetR12_2: R12.2 U1.6(2Y)
NetR13_2: R13.2 U1.8(3Y)
NetR14_2: R14.2 U1.11(4Y)
NetR23_1: R23.1 U2.3(1Y)
NetR28_1: R28.1 U2.2(1A) U3.7(COL_OUT)
NetR36_1: R36.1 R37.1 U4.2(-IN)

Not connected (* = marked no-connect by the designer): Q2 7(4_ANODE)* 10(C)*; U2 11(4Y)* 12(4A)* 13(4~{OE})*; U3 5(BALANCE)* 6(BAL/STRB)*; U4 1(NC)* 5(NC)* 8(NC)*

### Notes on the sheet
- (in symbol LM311D) +; -
- (in symbol TLP281-4_GB-TP,J,F) TLP281-4(GB-TP,J,F

### Library data of the parts
C3-C6 = C 1206  100V X7R - 100n: as C19 on sheet Power; Mount Type: SMT; Publisher: Hefest; Manufacturer Alternate: *; Part Number Alternate: *; Published: 07.04.2019; Supplier 1: Comet; Supplier Part Number 1: C1206 100nF 100V X7R SAMSUNG; RoHS: Y; Technology: Ceramic  MLCC; Package: 1206; VDC: 100V; TempCo: X7R; Tolerance %: ±10%; VAC: *; ESR Ohm: *; ComponentLink1Description: Datasheet Link; ComponentLink1URL: https://store.comet.bg/download-file.php?id=11; Temperature Range: -55°C ~ +125°C; Price: 0.090; ComponentLink2Description: Characteristics data; ComponentLink2URL: https://store.comet.bg/download-file.php?id=3821
  C3 C4 C6: Value: 100n
  C5: Value: 10u
Pot_B1 = RES_POT_LIN
R7-R38 = R 1206-5%: as R64 on sheet Power; Part Number: *; Mount Type: SMT; Publisher: Hefest; Manufacturer Alternate: *; Published: 07.04.2019; Supplier 1: Comet; Supplier Part Number 1: R1206 1.0K 5% YAG/ASJ; RoHS: Y; Technology: Thick film; Package: 1206; VDC: 200V; Tolerance %: ±5%; ComponentLink1Description: Datasheet Link; ComponentLink1URL: https://store.comet.bg/download-file.php?id=140; Temperature Range: -55°C ~ +155°C; Price: 0.054; Part Number Alternate: *; TYPE: Resistor; Power: 0.25W
  R7-R10 R15-R17 R20 R24 R25 R27 R28 R31 R32 R34 R36: Value: 10k
  R11-R14 R21-R23: Value: 499
  R18 R19 R26 R35: Value: 2.2k
  R29 R30: Value: 100
  R33 R37: Value: 1k
  R38: Value: 0
U1 U2 = SN74HC125D: Quadruple Bus Buffer Gates With 3-State Outputs, D0014A, TUBE; tpd @ Nom Voltage(Max)(ns): 26; Input Type: CMOS; Voltage(Nom)(V): 6; Bits(#): 4; VCC(Min)(V): 2; F @ Nom Voltage(Max)(Mhz): 28; Rating: Catalog; ICC @ Nom Voltage(Max)(mA): 0.16; ComponentLink1Description: Manufacturer URL; ComponentLink2Description: Datasheet; Part Number: SN74HC125; DatasheetVersion: SCLS104D; ComponentLink1URL: http://www.ti.com/; Output Type: CMOS; ComponentLink2URL: http://www.ti.com/lit/ds/symlink/sn74hc125.pdf; Operating Temperature Range(C): -40 to 85; Code_IPC: MS-012; VCC(Max)(V): 6; PartNumber: SN74HC125D; PackageVersion: http://www.ti.com/lit/ml/mpds177g/mpds177g.pdf; PackageReference: D0014A
U4 = AD8051ARZ: Single Channel Single-Supply Operation Operational Amplifier, 110 MHz BW, 170 V/us SR, Industrial, 8-pin SOIC (R-8), Tube; Generic Part Number: AD8051; Manufacturer: Analog Devices; Amplifiers Per Package: 1; Small Signal Bandwidth: 110MHz; V Span Min: 3V; Iq/Amp: 5.5mA; Input Bias Current: 1.4uA; V Span Max: 12V; Input Offset Voltage: 1.7mV; PartNumber: AD8051ARZ; PackageVersion: 060506-A; ComponentLink1Description: Manufacturer URL; ComponentLink2Description: Datasheet; DatasheetVersion: Rev. J; ComponentLink3URL: http://www.analog.com/static/imported-files/packages/PKG_PDF/SOIC_Narrow%20(R)/R_8.pdf; ComponentLink1URL: http://www.analog.com/en/index.html; Code_JEDEC: MS-012-AA; Packing: Tube; ComponentLink2URL: http://www.analog.com/static/imported-files/data_sheets/AD8051_8052_8054.pdf; PackageReference: R-8; ComponentLink3Description: Package Specification; Slew Rate: 170V/us; Mounting Technology: Surface Mount; PackageDescription: 8-Pin Standard Small Outline Package, Body 3.9 x 4.9 mm, Pitch 1.27 mm

## Sheet Pressure_Sensor.SchDoc
size A4
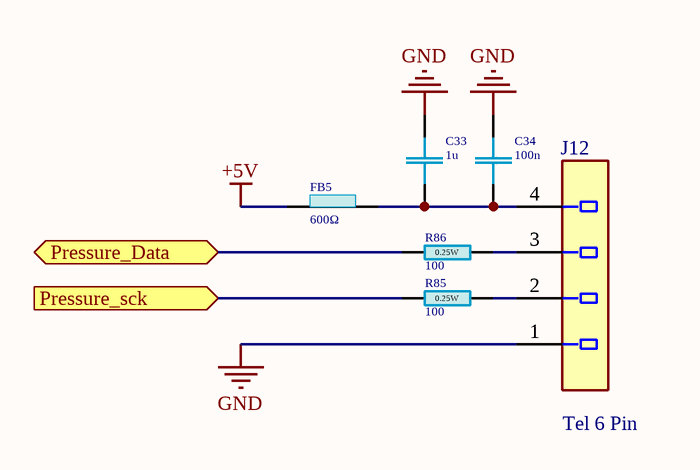
[diagram p7: Pressure_Sensor.SchDoc]

### Parts
C33  1u  [C1206]
C34  100n  [C1206]
FB5  ZTyp@100MHz: 600Ω  [L1206]  (hidden comment: 0.955u)
J12  Tel 6 Pin  [TE_640454-4_0]
R85  100  [R1206]
R86  100  [R1206]

### Ports
Pressure_Data (bidir), Pressure_sck (in)

### Nets
+5V: FB5.1
GND: C33.2 C34.1 J12.1
Pressure_Data: R86.1 ; port Pressure_Data
Pressure_sck: R85.1 ; port Pressure_sck
NetC33_1: C33.1 C34.2 FB5.2 J12.4
NetJ12_2: J12.2 R85.2
NetJ12_3: J12.3 R86.2

### Library data of the parts
C33 C34 = C 1206  100V X7R - 100n: SMD 1206   100V X7R 10%; Part Number: CL31B104KCFNNNE; Manufacturer: Samsung; TYPE: Capacitors; VDC: 16V; Package-mm: 3216; Mount Type: SMT; Publisher: Hefest; Manufacturer Alternate: *; Part Number Alternate: *; Published: 07.04.2019; Supplier 1: Comet; Supplier Part Number 1: C1206 100nF 100V X7R SAMSUNG; RoHS: Y; Technology: Ceramic  MLCC; Package: 1206; TempCo: X7R; Tolerance %: ±10%; VAC: *; ESR Ohm: *; ComponentLink1Description: Datasheet Link; ComponentLink1URL: https://store.comet.bg/download-file.php?id=11; Temperature Range: -55°C ~ +125°C; Price: 0.090; ComponentLink2Description: Characteristics data; ComponentLink2URL: https://store.comet.bg/download-file.php?id=3821
  C33: Value: 1u
  C34: Value: 100n
FB5 = FB BLM31P 600: as FB2 on sheet Power; Temperature Range: -55°C ~ +125°C; Imax: 1.5A; Irms: *; Isat: *; Technology: Chip; Published: 07.04.2019; Publisher: Hefest; Mount Type: SMT; Package: 1206; ComponentLink1Description: Datasheet Link; ComponentLink1URL: https://store.comet.bg/download-file.php?id=5324; RoHS: Y; Ztyp@1GHz: *; Manufacturer Alternate: *; Supplier 1: Comet; Supplier Part Number 1: BLM31PG601SN1L; Part Number Alternate: *; Price: 0.161; Value: 0.955u
J12 = Conn_TE_640454-4_eec: CONN 4 Positions Header, Unshrouded Connector 0.100" (2.54mm) Through Hole Tin; Manufacturer: TE; Part Number: 640454-4; helpURL: https://upverter.com/upn/revision/6b0ee12ed291c9c0/; ComponentLink2Description: Datasheet; Temperature: -55°C to +105°C; Package: HDR4; Supplier 2: Mouser; Price: 0.112358212788; Supplier 1: Digi-Key; ComponentLink1URL: https://upverter.com/upn/revision/6b0ee12ed291c9c0/; Supplier Part Number 2: 571-6404544; Supplier Part Number 1: A19431-ND; ComponentLink1Description: Upverter; ComponentLink2URL: http://datasheet.octopart.com/640454-4-TE-Connectivity---AMP-datasheet-26529718.pdf; RoHS: TRUE; Mouser Part Number: 571-6404544; Temperature Range High: +105°C; Digikey Description: CONN 4 Positions Header, Unshrouded Connector 0.100" (2.54mm) Through Hole Tin; Digikey Part Number: A19431-ND; Temperature Range Low: -55°C; Lead Free: yes
R85 R86 = R 1206-5%: as R64 on sheet Power; Part Number: *; Mount Type: SMT; Publisher: Hefest; Manufacturer Alternate: *; Published: 07.04.2019; Supplier 1: Comet; Supplier Part Number 1: R1206 1.0K 5% YAG/ASJ; RoHS: Y; Technology: Thick film; Package: 1206; VDC: 200V; Tolerance %: ±5%; ComponentLink1Description: Datasheet Link; ComponentLink1URL: https://store.comet.bg/download-file.php?id=140; Temperature Range: -55°C ~ +155°C; Price: 0.054; Part Number Alternate: *; TYPE: Resistor; Power: 0.25W; Value: 100

## Nets that join several sheets
+5V: Top (5 pins), Power (6 pins), Arduino (D3.2), Pannel_PB_LED (8 pins), Board_PB_LED (R1.1 R2.1), Moto_Driver (R15.1 R16.1 R17.1 U1.14), Pressure_Sensor (FB5.1)
+5V_M: Top (J5.1), Power (J2.1), Moto_Driver (R18.1 U4.7)
+6V_M: Top (J6.2), Power (5 pins), Moto_Driver (6 pins)
+12_IN: Top (J9.10 J9.11), Power (F1.1)
+12V_M: Power (7 pins), Moto_Driver (9 pins)
GND: Top (13 pins), Power (15 pins), Arduino (11 pins), Pannel_PB_LED (8 pins), Volume (C11.2 C12.2 C13.2 C14.2), Board_PB_LED (6 pins), Moto_Driver (40 pins), Pressure_Sensor (C33.2 C34.1 J12.1)
GND_IN: Top (9 pins), Power (R63.1 Rect1.B)
BLED_ard1: Arduino (U5.43), Board_PB_LED (R5.2)
BLED_ard2: Arduino (U5.47), Board_PB_LED (R6.2)
BPB_ard1: Arduino (U5.52), Board_PB_LED (C1.1 R3.1)
BPB_ard2: Arduino (U5.50), Board_PB_LED (C2.1 R4.1)
CS1: Top (J11.15), Arduino (U5.36)
CS2: Top (J11.16), Arduino (U5.34)
DB0: Top (J11.7), Arduino (U5.44)
DB1: Top (J11.8), Arduino (U5.26)
DB2: Top (J11.9), Arduino (U5.42)
DB3: Top (J11.10), Arduino (U5.28)
DB4: Top (J11.11), Arduino (U5.40)
DB5: Top (J11.12), Arduino (U5.30)
DB6: Top (J11.13), Arduino (U5.38)
DB7: Top (J11.14), Arduino (U5.32)
E: Top (J11.6), Arduino (U5.24)
Motor_CNT1: Arduino (U5.18), Moto_Driver (R7.2 U1.2)
Motor_CNT2: Arduino (U5.17), Moto_Driver (R8.1 U1.5)
Motor_DIR_In: Top (J6.4), Moto_Driver (R30.1 R32.2 TP_DIR.1)
Motor_DIR_MCU: Arduino (U5.20), Moto_Driver (Q2.14 R16.2)
Motor_IMP_In: Top (J6.5), Moto_Driver (R29.1 R31.2 TP_IMP.1)
Motor_IMP_MCU: Arduino (U5.21), Moto_Driver (Q2.16 R15.2)
Motor_On_In: Top (J4.2), Moto_Driver (Q5.3 R34.2 R38.1)
Motor_On_Off: Arduino (U5.16), Moto_Driver (R10.1 U1.12)
Motor_On_Out: Top (J4.1), Moto_Driver (Q5.2)
Motor_Out1: Top (J3.3), Moto_Driver (5 pins)
Motor_Out2: Top (J3.1), Moto_Driver (5 pins)
Motor_Speed_CNT: Arduino (U5.15), Moto_Driver (R9.1 U1.9)
Motor_Speed_Out: Top (J5.2), Moto_Driver (R37.2 TP_MSPD.1 U4.6)
Motor_Temp_Alarm: Arduino (U5.19), Moto_Driver (Q2.12 R17.2)
Motor_Temp_In: Top (J6.3), Moto_Driver (R35.1 TP_TMP.1)
PLED_ard1: Arduino (U5.10), Pannel_PB_LED (Q6.G R48.1)
PLED_ard2: Arduino (U5.11), Pannel_PB_LED (Q7.G R49.1)
PLED_ard3: Arduino (U5.12), Pannel_PB_LED (Q8.G R50.1)
PLED_ard4: Arduino (U5.9), Pannel_PB_LED (Q9.G R51.1)
PLED_Out1: Top (J10.3), Pannel_PB_LED (R52.2)
PLED_Out2: Top (J10.4), Pannel_PB_LED (R53.2)
PLED_Out3: Top (J10.5), Pannel_PB_LED (R54.2)
PLED_Out4: Top (J10.6), Pannel_PB_LED (R55.2)
PPB_ard1: Arduino (U5.2), Pannel_PB_LED (C7.1 R44.1)
PPB_ard2: Arduino (U5.3), Pannel_PB_LED (C8.1 R45.1)
PPB_ard3: Arduino (U5.4), Pannel_PB_LED (C9.1 R46.1)
PPB_ard4: Arduino (U5.5), Pannel_PB_LED (C10.1 R47.1)
PPB_In1: Top (J8.6), Pannel_PB_LED (R40.2 R44.2)
PPB_In2: Top (J8.5), Pannel_PB_LED (R41.2 R45.2)
PPB_In3: Top (J8.4), Pannel_PB_LED (R42.2 R46.2)
PPB_In4: Top (J8.3), Pannel_PB_LED (R43.2 R47.2)
Pressure_Data: Arduino (U5.82), Pressure_Sensor (R86.1)
Pressure_sck: Arduino (U5.83), Pressure_Sensor (R85.1)
Rs: Top (J11.4), Arduino (U5.22)
Rw: Top (J11.5), Arduino (U5.46)
Volume1: Arduino (U5.68), Volume (C11.1 R56.1)
Volume2: Arduino (U5.70), Volume (C12.1 R57.1)
Volume3: Arduino (U5.72), Volume (C13.1 R58.1)
Volume4: Arduino (U5.67), Volume (C14.1 R59.1)
Volume_In1: Top (J7.4), Volume (R56.2)
Volume_In2: Top (J7.3), Volume (R57.2)
Volume_In3: Top (J7.1), Volume (R58.2)
Volume_In4: Top (J7.2), Volume (R59.2)